# Altium project 称重信号的放大电路.PrjPcb
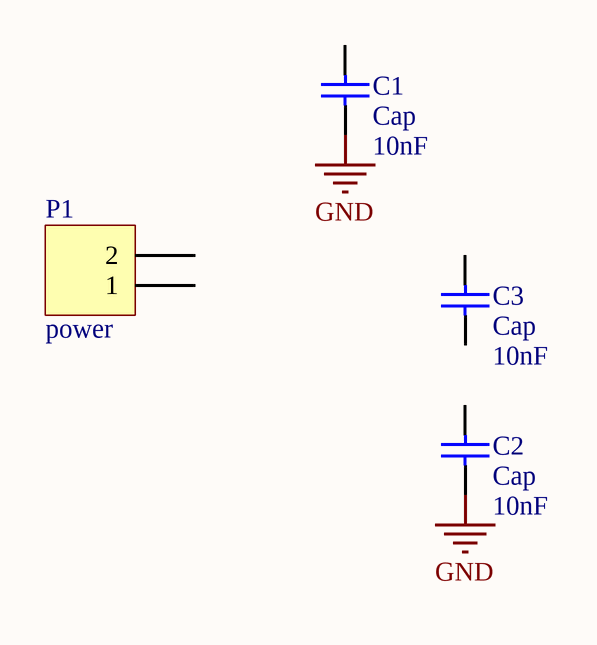
[diagram p0: Sheet1.SchDoc]
1 sheet, 4 parts. Net scope: global (net labels, ports and power ports of the same name join across sheets).

## Sheet Sheet1.SchDoc
size A4; SheetNumber: 1; SheetTotal: 1; SPICEModelCacheGAVLACYU: <root> / <DocumentId>GAVLACYU</DocumentId> / </root>

### Parts
C1  Cap  value 10nF  [RAD-0.3]
C2  Cap  value 10nF  [RAD-0.3]
C3  Cap  value 10nF  [RAD-0.3]
P1  power  [HDR1X2]

### Nets
GND: C1.1 C2.1

Not connected (* = marked no-connect by the designer): C1 2; C2 2; C3 1 2; P1 1 2

### Library data of the parts
C1-C3 = Cap: Capacitor; Published: 8-Jun-2000; LatestRevisionDate: 17-Jul-2002; LatestRevisionNote: Re-released for DXP Platform.; PackageReference: RAD-0.3; Publisher: Altium Limited; PackageDescription: Radial Cap, Thru-Hole; 2 Leads; 0.3 in Pin Spacing
P1 = Header 2: Header, 2-Pin; LatestRevisionDate: 17-Jul-2002; LatestRevisionNote: Re-released for DXP Platform.; Publisher: Altium Limited